# EAGLE design nano2_dps310 (EAGLE 7.6.0)
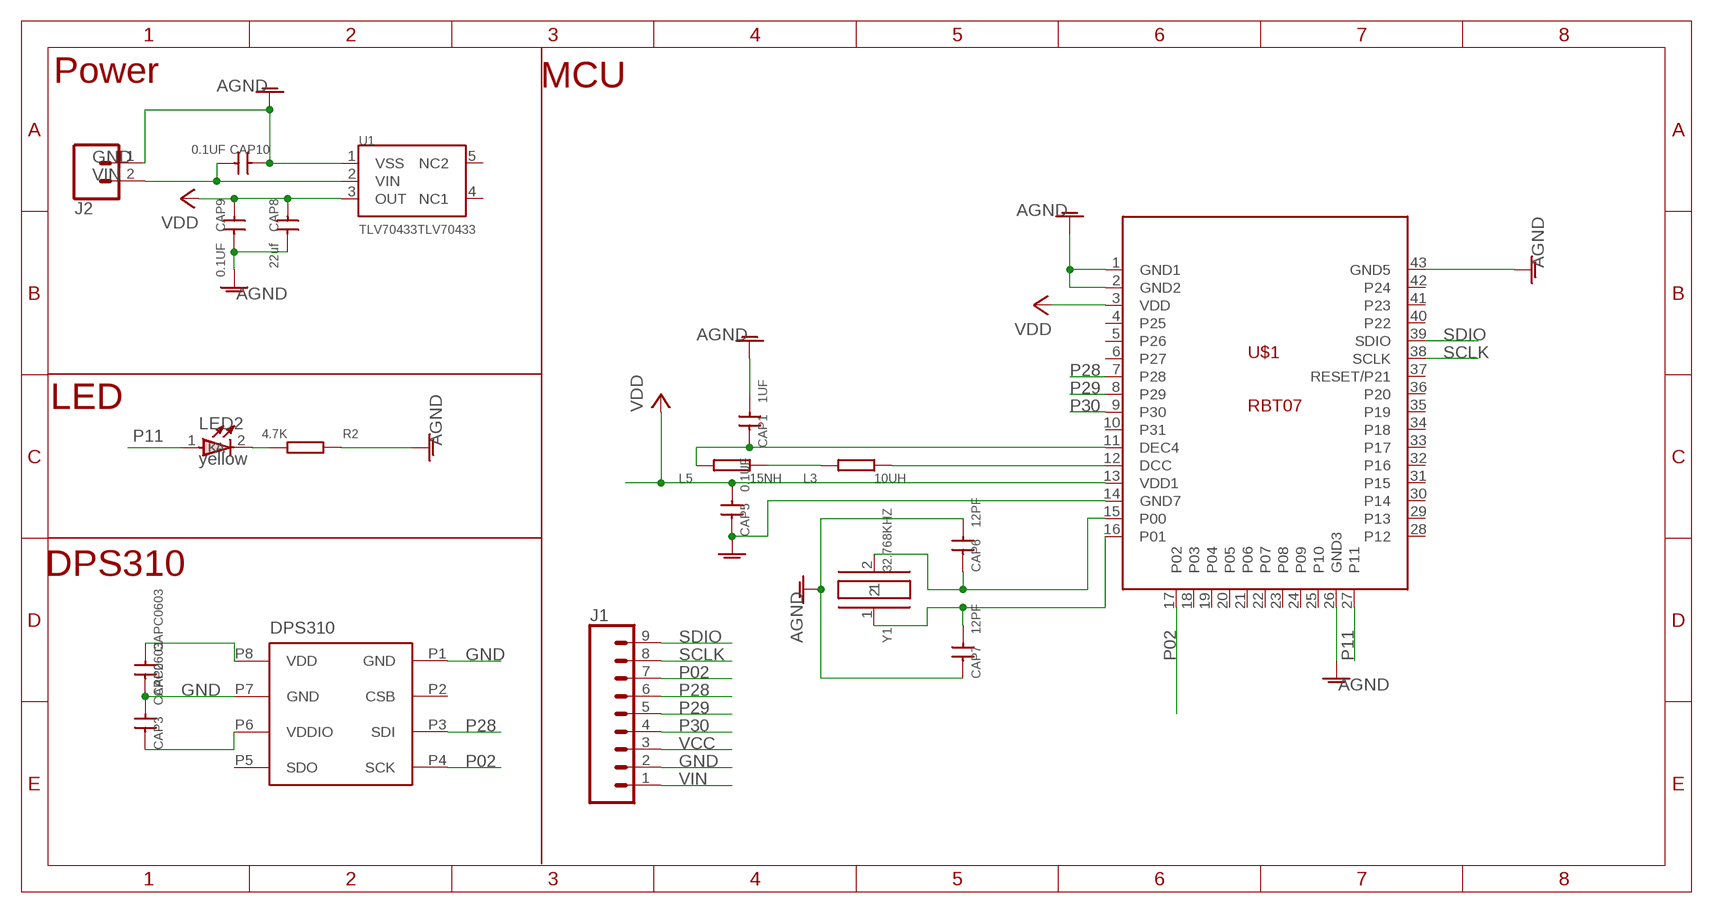
[diagram p0: schematic, sheet 1]

## Parts
CAP1  1UF  CAP0402  [C-0402]
CAP2  CAPC0603  [C0603]
CAP3  CAPC0603  [C0603]
CAP5  0.1UF  CAP0402  [C-0402]
CAP6  12PF  CAP0402  [C-0402]
CAP7  12PF  CAP0402  [C-0402]
CAP8  22uf  CAPC0805  [C0805]
CAP9  0.1UF  CAP0402  [C-0402]
CAP10  0.1UF  CAP0402  [C-0402]
J1  CONN_09LOCK  [1X09_LOCK]
J2  CONN_02JST-PTH-2  [JST-2-PTH]
L3  10UH  RESR0603  [R0603]
L5  15NH  RESR0402  [R0402]
LED2  yellow  LED  [LED0603]
R2  4.7K  RESR0402  [R0402]
U1  TLV70433TLV70433  [SOT-23-5]
U2  DPS310  [LGA-8]
U$1  RBT07  [RBT07]
Y1  32.768KHZ  CRY_32153215  [CRY_3215]

## Nets
GND: CAP1.1 CAP2.2 CAP3.1 CAP5.2 CAP6.1 CAP7.2 CAP8.1 CAP9.1 CAP10.2 J1.2 J2.1 R2.1 U1.1(VSS) U2.P1(GND) U2.P7(GND) U$1.1(GND1) U$1.2(GND2) U$1.14(GND7) U$1.26(GND3) U$1.43(GND5) ; supply symbol labelled AGND
N$2: L3.2 U$1.12(DCC)
N$3: L3.1 L5.2
N$5: CAP1.2 L5.1 U$1.11(DEC4)
N$7: CAP6.2 U$1.15(P00) Y1.2
N$13: LED2.2(K) R2.2
N$19: CAP7.1 U$1.16(P01) Y1.1
P02: J1.7 U2.P4(SCK) U$1.17(P02)
P11: LED2.1(A) U$1.27(P11)
P28: J1.6 U2.P3(SDI) U$1.7(P28)
P29: J1.5 U$1.8(P29)
P30: J1.4 U$1.9(P30)
SCLK: J1.8 U$1.38(SCLK)
SDIO: J1.9 U$1.39(SDIO)
VCC: CAP2.1 CAP3.2 CAP5.1 CAP8.2 CAP9.2 J1.3 U1.3(OUT) U2.P6(VDDIO) U2.P8(VDD) U$1.3(VDD) U$1.13(VDD1) ; supply symbol labelled VDD
VIN: CAP10.1 J1.1 J2.2 U1.2(VIN)
Unconnected: U1.4(NC1) U1.5(NC2) U2.P2(CSB) U2.P5(SDO) U$1.4(P25) U$1.5(P26) U$1.6(P27) U$1.10(P31) U$1.18(P03) U$1.19(P04) U$1.20(P05) U$1.21(P06) U$1.22(P07) U$1.23(P08) U$1.24(P09) U$1.25(P10) U$1.28(P12) U$1.29(P13) U$1.30(P14) U$1.31(P15) U$1.32(P16) U$1.33(P17) U$1.34(P18) U$1.35(P19) U$1.36(P20) U$1.37(RESET/P21) U$1.40(P22) U$1.41(P23) U$1.42(P24)

## Notes on the sheet
- Power | MCU
- LED
- DPS310

## Library data of the parts
CAP1 CAP5-CAP9 = NANO2:CAP: CAP
CAP2 CAP3 CAP10 = 1RedBeard:CAP: CAP
J1 = SparkFun-Connectors:CONN_09: Multi connection point. Often used as Generic Header-pin footprint for 0.1 inch spaced/style header connections On any of the 0.1 inch spaced packages, you can populate with these: Break Away Headers - Straight <https://www.sparkfun.com/products/116> (PRT-00116) Break Away Male Headers - Right Angle <https://www.sparkfun.com/products/553> (PRT-00553) Female Headers <https://www.sparkfun.com/products/115> (PRT-00115) Break Away Headers - Machine Pin <https://www.sparkfun.com/products/117> (PRT-00117) Break Away Female Headers - Swiss Machine Pin <https://www.sparkfun.com/products/743> (PRT-00743) For SCREWTERMINALS and SPRING TERMINALS visit here: Screw Terimnals on SparkFun.com <https://www.sparkfun.com/search/results?term=Screw+Terminals> (5mm/3.5mm/2.54mm spacing) This device is also useful as a general connection point to wire up your design to another part of your project. Our various solder wires solder well into these plated through hole pads. Hook-Up Wire - Assortment (Stranded, 22 AWG) <https://www.sparkfun.com/products/11375> (PRT-11375) Hook-Up Wire - Assortment (Solid Core, 22 AWG) <https://www.sparkfun.com/products/11367> (PRT-11367) View the entire wire category on our website here <https://www.sparkfun.com/categories/141> Special notes: Molex polarized connector foot print use with SKU : PRT-08231 with associated crimp pins and housings. 1MM SMD Version SKU: PRT-10208 NOTES ON THE VARIANTS LOCK and LOCK_LONGPADS... This footprint was designed to help hold the alignment of a through-hole component (i.e. 6-pin header) while soldering it into place. You may notice that each hole has been shifted either up or down by 0.005 of an inch from it's more standard position (which is a perfectly straight line). This slight alteration caused the pins (the squares in the middle) to touch the edges of the holes. Because they are alternating, it causes a "brace" to hold the component in place. 0.005 has proven to be the perfect amount of "off-center" position when using our standard breakaway headers. Although looks a little odd when you look at the bare footprint, once you have a header in there, the alteration is very hard to notice. Also,if you push a header all the way into place, it is covered up entirely on the bottom side.
J2 = SparkFun-Connectors:CONN_02: Multi connection point. Often used as Generic Header-pin footprint for 0.1 inch spaced/style header connections On any of the 0.1 inch spaced packages, you can populate with these: Break Away Headers - Straight <https://www.sparkfun.com/products/116> (PRT-00116) Break Away Male Headers - Right Angle <https://www.sparkfun.com/products/553> (PRT-00553) Female Headers <https://www.sparkfun.com/products/115> (PRT-00115) Break Away Headers - Machine Pin <https://www.sparkfun.com/products/117> (PRT-00117) Break Away Female Headers - Swiss Machine Pin <https://www.sparkfun.com/products/743> (PRT-00743) For SCREWTERMINALS and SPRING TERMINALS visit here: Screw Terimnals on SparkFun.com <https://www.sparkfun.com/search/results?term=Screw+Terminals> (5mm/3.5mm/2.54mm spacing) This device is also useful as a general connection point to wire up your design to another part of your project. Our various solder wires solder well into these plated through hole pads. Hook-Up Wire - Assortment (Stranded, 22 AWG) <https://www.sparkfun.com/products/11375> (PRT-11375) Hook-Up Wire - Assortment (Solid Core, 22 AWG) <https://www.sparkfun.com/products/11367> (PRT-11367) View the entire wire category on our website here <https://www.sparkfun.com/categories/141> Special notes: Molex polarized connector foot print use with: PRT-08233 with associated crimp pins and housings. 2.54_SCREWTERM for use with PRT-10571. 3.5mm Screw Terminal footprints for PRT-08084 5mm Screw Terminal footprints for use with PRT-08432; PROD_ID: CONN-09863; SKU: PRT-09914
L3 L5 R2 = 1RedBeard:RES: RES
LED2 = RedBeard:LED: LED
U1 = NANO2:TLV70433: TLV70433; U1: TLV70433DBVR
U2 = LGA-8:DPS310
U$1 = 1RedBeard:RBT07
Y1 = RedBeard:CRY_3215

## Net classes
0 default: clearance 0.205 mm

## Board
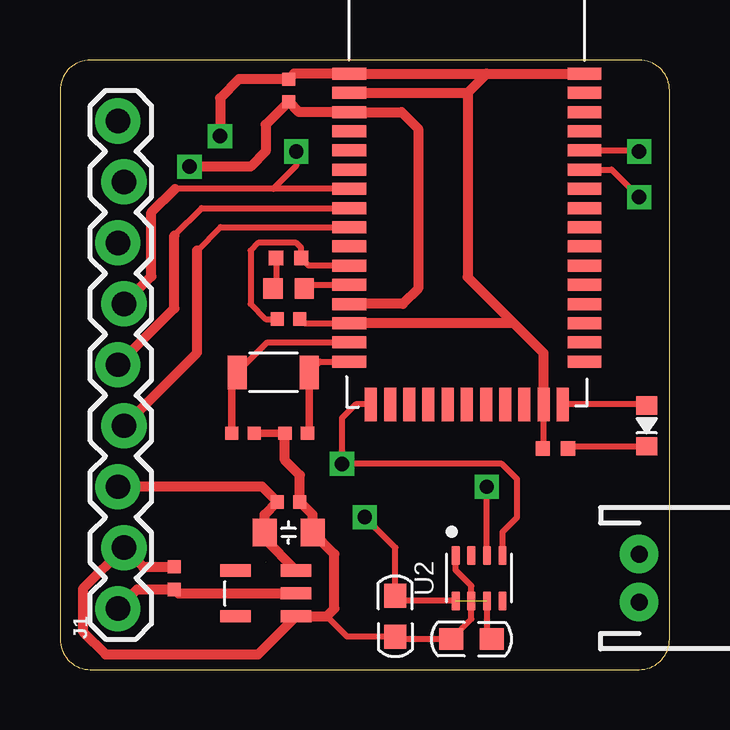
[diagram p1: board, top side]
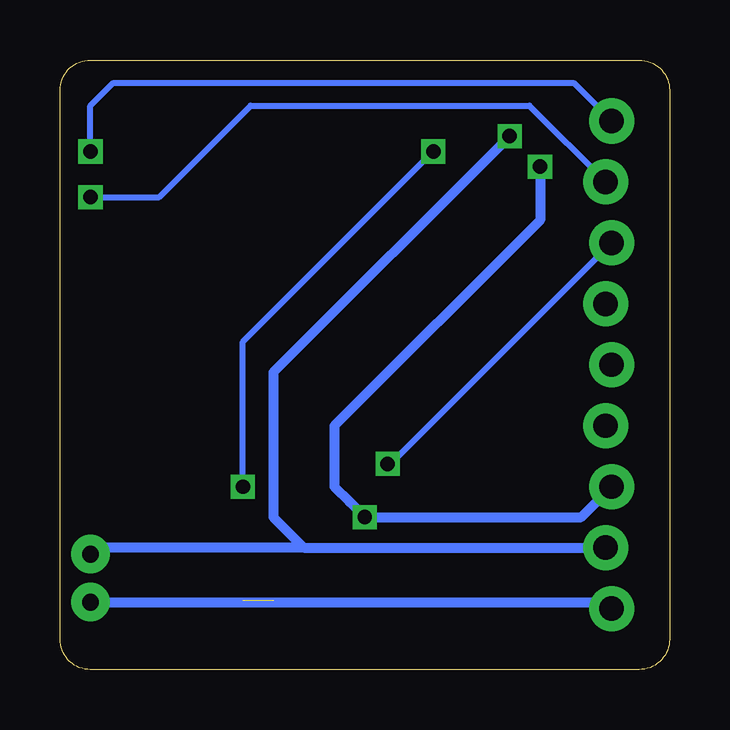
[diagram p2: board, bottom side, seen from below]

Size 25.4 x 25.4 mm. Coordinates in mm from the lower left corner, seen from the top.
Outline: 1.27,0 24.13,0 arc90 25.4,1.27 25.4,24.13 arc90 24.13,25.4 1.27,25.4 arc90 0,24.13 0,1.27 arc90 1.27,0
Copper layers (1*16): Top 0.035mm / dielectric 1.5mm / Bottom 0.035mm
Design rules "default": minimum track width 10mil, minimum drill 24mil, track to track 8mil, track to pad 8mil, pad to pad 8mil, via to via 8mil, smd to smd 8mil, copper to edge 40mil, drill to drill 8mil, minimum pad ring 10mil, minimum via ring 8mil, stop-mask expansion 4mil, vias tented up to drill 0mil, thermal gap 10mil

### Footprints (pad centres in the part's own frame; a part is rotated, then mirrored left to right if it is on the bottom)
C-0402 = smd 0.55 x 0.55: 1 -0.47,0; 2 0.47,0
C0603 = smd 1 x 0.9: 1 -0.85,0; 2 0.85,0
C0805 = smd 1 x 1.146: 1 -1,0; 2 1,0
1X09_LOCK = drill 1.016 pad 1.88: 1 0,0.127; 2 2.54,-0.127; 3 5.08,0.127; 4 7.62,-0.127; 5 10.16,0.127; 6 12.7,-0.127; 7 15.24,0.127; 8 17.78,-0.127; 9 20.32,0.127
JST-2-PTH = drill 0.7 pad 1.6: 1 -1,0; 2 1,0
R0603 = smd 0.8 x 0.85: 1 -0.65,0; 2 0.65,0
R0402 = smd 0.6 x 0.6: 1 -0.525,0; 2 0.525,0
LED0603 = smd 0.762 x 0.889: 1 -0.85,0; 2 0.85,0
SOT-23-5 = smd 1.27 x 0.508: 1 -1.27,0.953; 2 -1.27,0; 3 -1.27,-0.953; 4 1.27,-0.953; 5 1.27,0.953
LGA-8 = smd 0.8 x 0.35: P1 0.95,0.975; P2 0.95,0.325; P3 0.95,-0.325; P4 0.95,-0.975; P5 -0.95,-0.975; P6 -0.95,-0.325; P7 -0.95,0.325; P8 -0.95,0.975
RBT07 = smd 1.4 x 0.5: 1 -0.649,13.085; 2 -0.649,12.285; 3 -0.649,11.485; 4 -0.649,10.685; 5 -0.649,9.885; 6 -0.649,9.085; 7 -0.649,8.285; 8 -0.649,7.485; 9 -0.649,6.685; 10 -0.649,5.885; 11 -0.649,5.085; 12 -0.649,4.285; 13 -0.649,3.485; 14 -0.649,2.685; 15 -0.649,1.885; 16 -0.649,1.085; 28 9.151,1.085; 29 9.151,1.885; 30 9.151,2.685; 31 9.151,3.485; 32 9.151,4.285; 33 9.151,5.085; 34 9.151,5.885; 35 9.151,6.685; 36 9.151,7.485; 37 9.151,8.285; 38 9.151,9.085; 39 9.151,9.885; 40 9.151,10.685; 41 9.151,11.485; 42 9.151,12.285; 43 9.151,13.085 | smd 0.5 x 1.4: 17 0.251,-0.7; 18 1.051,-0.7; 19 1.851,-0.7; 20 2.651,-0.7; 21 3.451,-0.7; 22 4.251,-0.7; 23 5.051,-0.7; 24 5.851,-0.7; 25 6.651,-0.7; 26 7.451,-0.7; 27 8.251,-0.7
CRY_3215 = smd 0.8 x 1.4: 1 -1.5,0; 2 1.5,0

### Placement (x,y rotation side)
CAP1  9.53,14.61 180 top
CAP2  17.14,1.27 180 top
CAP3  13.97,2.22 90 top
CAP5  9.53,6.99 0 top
CAP6  7.62,9.84 180 top
CAP7  9.84,9.84 180 top
CAP8  9.53,5.71 180 top
CAP9  9.53,24.13 270 top
CAP10  4.76,3.81 90 top
J1  2.54,2.54 90 top
J2  24.13,3.81 270 top
L3  9.53,15.88 0 top
L5  9.53,17.14 180 top
LED2  24.45,10.16 270 top
R2  20.64,9.21 0 top
U1  8.57,3.17 180 top
U2  17.46,3.81 90 top
U$1  12.7,11.75 0 top
Y1  8.89,12.38 180 top

### Tracks (layer width: path | path; a pad name or v marks a point on that pad's centre or on a via)
GND  (via drill 0.6)
  Top 0.254: CAP1.1 10.17,14.43 U$1.14 | R2.1 20.15,9.25 U$1.26 | U2.P1 16.49,4.15 17.14,3.49 U2.P7 17.14,2.11 CAP2.2 14.07,1.27 CAP3.1 11.96,1.37 11.11,2.22
  Top 0.305: CAP7.2 CAP6.1
  Top 0.406: 17.78,24.83 U$1.1 9.76,24.83 CAP9.1 7.46,24.6 6.67,23.81 v6.67,22.23 | 17.78,24.83 U$1.43 | U$1.2 16.98,24.03 | 16.98,24.03 17.78,24.83 | U$1.26 20.15,13.19 18.91,14.43 | 18.91,14.43 U$1.14 | 16.98,24.03 16.98,16.36 18.91,14.43 | CAP10.2 3.47,4.28 J1.2 0.95,3.37 0.95,1.59 1.91,0.64 8.26,0.64 U1.1 11.11,2.22 11.43,2.54 11.43,4.81 CAP8.1 10.53,6.46 CAP5.2 9.99,8.1 9.37,8.72 CAP7.2
  Bottom 0.406: 15.24,5.08 16.51,6.35 16.51,12.38 v6.67,22.23 | 15.24,5.08 J1.2 | 15.24,5.08 23.86,5.08 J2.1
N$2
  Top 0.254: L3.2 10.33,16.03 U$1.12
N$3
  Top 0.254: L5.2 9,16 L3.1
N$5
  Top 0.254: U$1.11 10.36,16.83 L5.1 10.05,17.57 9.84,17.78 8.26,17.78 7.94,17.46 7.94,15.24 8.57,14.61 CAP1.2
N$7
  Top 0.254: Y1.2 8.64,13.63 U$1.15
  Top 0.305: Y1.2 7.15,12.14 CAP6.2
N$13
  Top 0.254: R2.2 21.27,9.31 LED2.2
N$19
  Top 0.254: Y1.1 10.84,12.83 U$1.16
  Top 0.305: Y1.1 10.39,9.92 CAP7.1
P02  (via drill 0.6)
  Top 0.254: U$1.17 12.32,11.05 11.75,10.48 v11.75,8.57 18.41,8.57 19.05,7.94 19.05,6.35 18.44,5.74 U2.P4
  Bottom 0.254: v11.75,8.57 11.62,8.57 J1.7
P11
  Top 0.254: LED2.1 24.41,11.05 U$1.27
P28  (via drill 0.6)
  Top 0.254: U$1.7 8.89,20.03 | 8.89,20.03 4.79,20.03 | v9.84,21.59 9.84,20.98 8.89,20.03 | U2.P3 v17.79,7.61 v17.78,7.62
  Top 0.406: J1.6 3.81,16.38 3.81,19.05 4.79,20.03
  Bottom 0.254: v9.84,21.59 17.78,13.65 v17.78,7.62
P29
  Top 0.254: 4.76,18.1 5.9,19.23 U$1.8
  Top 0.406: J1.5 4.76,15.05 4.76,18.1
P30
  Top 0.254: 5.71,17.46 6.68,18.43 U$1.9
  Top 0.406: J1.4 5.71,13.21 5.71,17.46
SCLK  (via drill 0.6)
  Top 0.254: U$1.38 22.98,20.83 v24.13,19.68
  Bottom 0.254: v24.13,19.68 21.27,19.68 17.46,23.5 5.84,23.5 J1.8
SDIO  (via drill 0.6)
  Top 0.254: U$1.39 24.09,21.63 v24.13,21.59
  Bottom 0.254: v24.13,21.59 24.13,23.5 23.18,24.45 4,24.45 J1.9
VCC  (via drill 0.6)  (1 unrouted)
  Top 0.254: U2.P8 14.18,2.86 CAP3.2 13.97,5.08 v12.7,6.35 | U2.P6 17.79,1.48 CAP2.1
  Top 0.406: U$1.13 14.29,15.24 14.92,15.88 14.92,22.54 14.23,23.23 U$1.3 9.95,23.23 CAP9.2 8.57,22.71 8.57,21.59 7.94,20.95 v5.4,20.95 | U1.3 8.53,5.45 CAP8.2 8.53,6.46 CAP5.1 8.42,7.62 J1.3
  Bottom 0.406: J1.3 3.68,6.35 v12.7,6.35 13.34,6.99 13.97,7.62 13.97,10.16 5.4,18.73 v5.4,20.95
VIN
  Top 0.406: J1.1 3.21,3.34 CAP10.1 4.93,3.17 U1.2
  Bottom 0.406: J2.2 2.68,2.81 J1.1